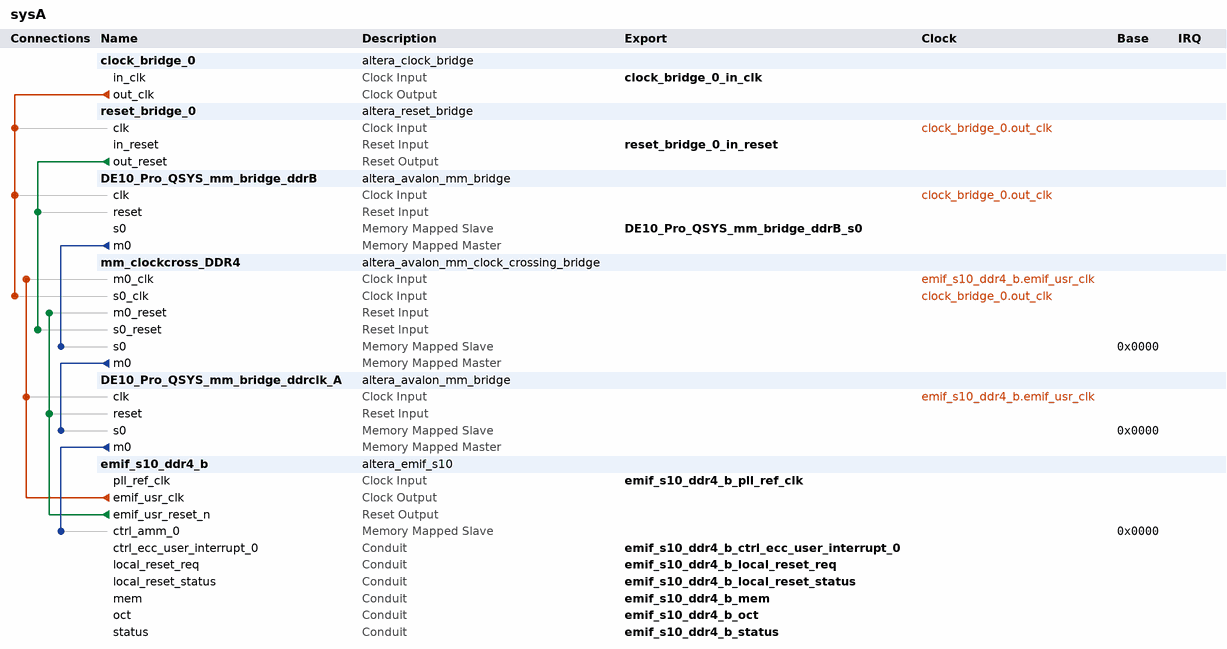
[diagram p0: system contents]
# Platform Designer (Qsys) system sysA, Stratix 10 1SX280HU2F50E1VG
# Parameters at their usual value, and those the tool derives, are not listed.
package require -exact qsys 1.0
create_system sysA
set_project_property DEVICE_FAMILY {Stratix 10}
set_project_property DEVICE 1SX280HU2F50E1VG

add_component clock_bridge_0 ip/sysA/sysA_clock_bridge_0.ip altera_clock_bridge clock_bridge_0 19.1
load_component clock_bridge_0
set_component_parameter_value DERIVED_CLOCK_RATE 100000000
set_component_parameter_value EXPLICIT_CLOCK_RATE 0
save_component

add_component reset_bridge_0 ip/sysA/sysA_reset_bridge_0.ip altera_reset_bridge reset_bridge_0 19.1
load_component reset_bridge_0
set_component_parameter_value ACTIVE_LOW_RESET 0
set_component_parameter_value SYNCHRONOUS_EDGES deassert
set_component_parameter_value SYNC_RESET 0
save_component

add_component DE10_Pro_QSYS_mm_bridge_ddrB ip/DE10_Pro_QSYS/DE10_Pro_QSYS_mm_bridge_ddrA.ip altera_avalon_mm_bridge DE10_Pro_QSYS_mm_bridge_ddrB 19.1

add_component mm_clockcross_DDR4 ip/DE10_Pro_QSYS/DE10_Pro_QSYS_mm_clockcross_DDR4.ip altera_avalon_mm_clock_crossing_bridge mm_clockcross_DDR4 19.1

add_component DE10_Pro_QSYS_mm_bridge_ddrclk_A ip/DE10_Pro_QSYS/DE10_Pro_QSYS_mm_bridge_ddrclk_A.ip altera_avalon_mm_bridge DE10_Pro_QSYS_mm_bridge_ddrclk_A 19.1

add_component emif_s10_ddr4_b ip/DE10_Pro_QSYS/DE10_Pro_QSYS_emif_s10_ddr4_b.ip altera_emif_s10 emif_s10_ddr4_b 19.1.0

# connections
add_connection clock_bridge_0.out_clk DE10_Pro_QSYS_mm_bridge_ddrB.clk clock
add_connection clock_bridge_0.out_clk mm_clockcross_DDR4.s0_clk clock
add_connection clock_bridge_0.out_clk reset_bridge_0.clk clock
add_connection emif_s10_ddr4_b.emif_usr_clk DE10_Pro_QSYS_mm_bridge_ddrclk_A.clk clock
add_connection emif_s10_ddr4_b.emif_usr_clk mm_clockcross_DDR4.m0_clk clock
add_connection emif_s10_ddr4_b.emif_usr_reset_n DE10_Pro_QSYS_mm_bridge_ddrclk_A.reset reset
add_connection emif_s10_ddr4_b.emif_usr_reset_n mm_clockcross_DDR4.m0_reset reset
add_connection reset_bridge_0.out_reset DE10_Pro_QSYS_mm_bridge_ddrB.reset reset
add_connection reset_bridge_0.out_reset mm_clockcross_DDR4.s0_reset reset
add_connection DE10_Pro_QSYS_mm_bridge_ddrB.m0 mm_clockcross_DDR4.s0 avalon
set_connection_parameter_value DE10_Pro_QSYS_mm_bridge_ddrB.m0/mm_clockcross_DDR4.s0 baseAddress 0x0000
add_connection DE10_Pro_QSYS_mm_bridge_ddrclk_A.m0 emif_s10_ddr4_b.ctrl_amm_0 avalon
set_connection_parameter_value DE10_Pro_QSYS_mm_bridge_ddrclk_A.m0/emif_s10_ddr4_b.ctrl_amm_0 baseAddress 0x0000
add_connection mm_clockcross_DDR4.m0 DE10_Pro_QSYS_mm_bridge_ddrclk_A.s0 avalon
set_connection_parameter_value mm_clockcross_DDR4.m0/DE10_Pro_QSYS_mm_bridge_ddrclk_A.s0 baseAddress 0x0000

# exported interfaces
add_interface DE10_Pro_QSYS_mm_bridge_ddrB_s0 avalon slave
set_interface_property DE10_Pro_QSYS_mm_bridge_ddrB_s0 EXPORT_OF DE10_Pro_QSYS_mm_bridge_ddrB.s0
add_interface clock_bridge_0_in_clk clock sink
set_interface_property clock_bridge_0_in_clk EXPORT_OF clock_bridge_0.in_clk
add_interface emif_s10_ddr4_b_ctrl_ecc_user_interrupt_0 conduit end
set_interface_property emif_s10_ddr4_b_ctrl_ecc_user_interrupt_0 EXPORT_OF emif_s10_ddr4_b.ctrl_ecc_user_interrupt_0
add_interface emif_s10_ddr4_b_local_reset_req conduit end
set_interface_property emif_s10_ddr4_b_local_reset_req EXPORT_OF emif_s10_ddr4_b.local_reset_req
add_interface emif_s10_ddr4_b_local_reset_status conduit end
set_interface_property emif_s10_ddr4_b_local_reset_status EXPORT_OF emif_s10_ddr4_b.local_reset_status
add_interface emif_s10_ddr4_b_mem conduit end
set_interface_property emif_s10_ddr4_b_mem EXPORT_OF emif_s10_ddr4_b.mem
add_interface emif_s10_ddr4_b_oct conduit end
set_interface_property emif_s10_ddr4_b_oct EXPORT_OF emif_s10_ddr4_b.oct
add_interface emif_s10_ddr4_b_pll_ref_clk clock sink
set_interface_property emif_s10_ddr4_b_pll_ref_clk EXPORT_OF emif_s10_ddr4_b.pll_ref_clk
add_interface emif_s10_ddr4_b_status conduit end
set_interface_property emif_s10_ddr4_b_status EXPORT_OF emif_s10_ddr4_b.status
add_interface reset_bridge_0_in_reset reset sink
set_interface_property reset_bridge_0_in_reset EXPORT_OF reset_bridge_0.in_reset

save_system sysA.qsys
